# EAGLE design TAU-ARD_V01 (EAGLE 9.7.0)
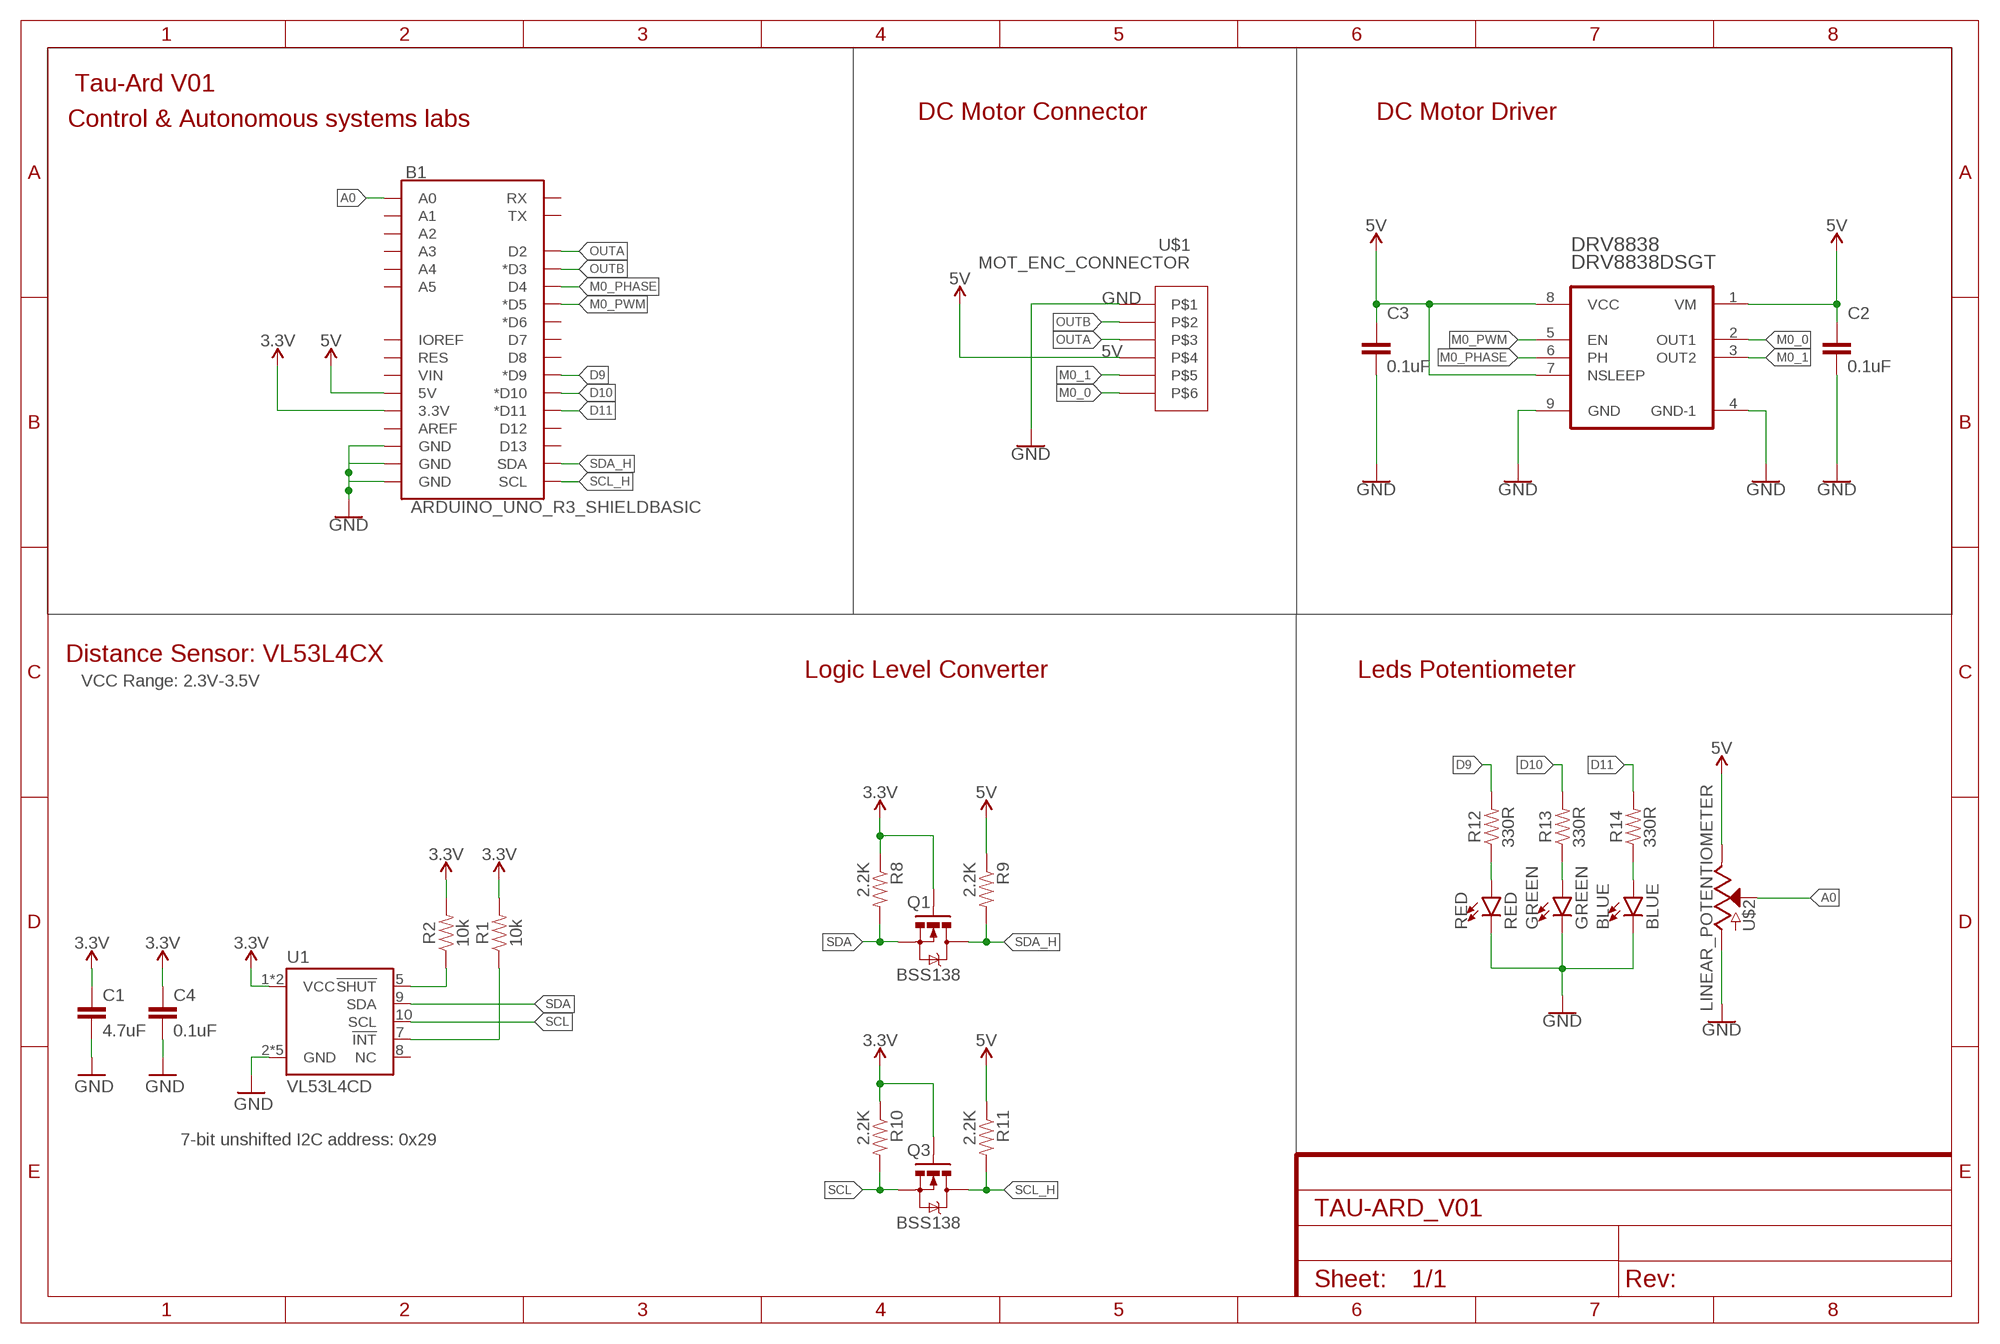
[diagram p0: schematic, sheet 1]

## Parts
B1  ARDUINO_UNO_R3_SHIELDBASIC  [UNO_R3_SHIELD]
BLUE  BLUE  LED-BLUE1206  [LED-1206]
C1  4.7uF  4.7UF-0603-6.3V-(10%)  [0603]
C2  0.1uF  0.1UF-0603-25V-(+80/-20%)  [0603]
C3  0.1uF  0.1UF-0603-25V-(+80/-20%)  [0603]
C4  0.1uF  0.1UF-0603-25V-(+80/-20%)  [0603]
DRV8838  DRV8838DSGT  [SON50P200X200X80-9N]
GREEN  GREEN  LED-GREEN1206  [LED-1206]
Q1  BSS138  MOSFET-NCHANNELSMD  [SOT23-3]
Q3  BSS138  MOSFET-NCHANNELSMD  [SOT23-3]
R1  10k  10KOHM-0603-1/10W-1%  [0603]
R2  10k  10KOHM-0603-1/10W-1%  [0603]
R8  2.2K  RESISTOR0603-RES  [0603-RES]
R9  2.2K  RESISTOR0603-RES  [0603-RES]
R10  2.2K  RESISTOR0603-RES  [0603-RES]
R11  2.2K  RESISTOR0603-RES  [0603-RES]
R12  330R  0.3OHM-0805-1/8W-1%  [0805]
R13  330R  0.3OHM-0805-1/8W-1%  [0805]
R14  330R  0.3OHM-0805-1/8W-1%  [0805]
RED  RED  LED-RED1206  [LED-1206]
U1  VL53L4CD  [VL53L4CD]
U$1  MOT_ENC_CONNECTOR  [6X1_CONNECTOR_2MM_SMD]
U$2  LINEAR_POTENTIOMETER  [PTA2043]

## Nets
3.3V: B1.3.3V C1.1 C4.1 Q1.1(G) Q3.1(G) R1.2 R2.2 R8.1 R10.1 U1.1(VCC) U1.11(VCC)
5V: B1.5V C2.1 C3.1 DRV8838.1(VM) DRV8838.7(NSLEEP) DRV8838.8(VCC) R9.1 R11.1 U$1.P$4 U$2.TOP(VCC)
!INT: R1.1 U1.7(!INT)
!SHUT: R2.1 U1.5(!SHUT)
A0: B1.A0 U$2.WIPER(SIG)
D9: B1.D9(*D9) R12.2
D10: B1.D10(*D10) R13.2
D11: B1.D11(*D11) R14.2
GND: B1.GND@0(GND) B1.GND@1(GND) B1.GND@2(GND) BLUE.C C1.2 C2.2 C3.2 C4.2 DRV8838.4(GND-1) DRV8838.9(GND) GREEN.C RED.C U1.2(GND) U1.3(GND) U1.4(GND) U1.6(GND) U1.12(GND) U$1.P$1 U$2.BOTTOM(GND)
M0_0: DRV8838.2(OUT1) U$1.P$6
M0_1: DRV8838.3(OUT2) U$1.P$5
M0_PHASE: B1.D4 DRV8838.6(PH)
M0_PWM: B1.D5(*D5) DRV8838.5(EN)
N$7: R12.1 RED.A
N$8: GREEN.A R13.1
N$9: BLUE.A R14.1
OUTA: B1.D2 U$1.P$3
OUTB: B1.D3(*D3) U$1.P$2
SCL: Q3.2(S) R10.2 U1.10(SCL)
SCL_H: B1.SCL Q3.3(D) R11.2
SDA: Q1.2(S) R8.2 U1.9(SDA)
SDA_H: B1.SDA Q1.3(D) R9.2
Unconnected: B1.A1 B1.A2 B1.A3 B1.A4 B1.A5 B1.AREF B1.D6(*D6) B1.D7 B1.D8 B1.D12 B1.D13 B1.IOREF B1.RES B1.RX B1.TX B1.VIN U1.8(NC)

## Notes on the sheet
- Tau-Ard V01
- Control & Autonomous systems labs | DC Motor Connector | DC Motor Driver
- Distance Sensor: VL53L4CX
- Logic Level Converter | Leds Potentiometer
- VCC Range: 2.3V-3.5V
- 7-bit unshifted I2C address: 0x29

## Library data of the parts
B1 = SparkFun-Boards:ARDUINO_UNO_R3_SHIELD: Arduino R3 Shield Footprint Shield form compatible with the Arduino Uno R3. SparkFun Products: MG2639 Cellular Shield <https://www.sparkfun.com/products/13120> MIDI Shield <https://www.sparkfun.com/products/12898> R3 Stackable Headers Kit <https://www.sparkfun.com/products/11417>
BLUE = SparkFun-LED:LED-BLUE: Blue SMD LED Used in manufacturing of various products at SparkFun Packages: 0603 - SMD 0603 package [Product Link] <http://www.digikey.com/product-detail/en/SMLE12BC7TT86/511-1589-2-ND/1641808> 1206 - SMD1206 package [Product Link] <http://www.digikey.com/product-detail/en/lite-on-inc/LTST-C150TBKT/160-1643-1-ND/573584> SparkFun Products: ESP8266 Thing-Dev Board <https://www.sparkfun.com/products/13711> RedBoard <https://www.sparkfun.com/products/12757>; PROD_ID: DIO-09911
C1 = SparkFun-Capacitors:4.7UF: 4.7µF ceramic capacitors A capacitor is a passive two-terminal electrical component used to store electrical energy temporarily in an electric field.; PROD_ID: CAP-08280
C2-C4 = SparkFun-Capacitors:0.1UF: 0.1µF ceramic capacitors A capacitor is a passive two-terminal electrical component used to store electrical energy temporarily in an electric field.; PROD_ID: CAP-00810
DRV8838 = DRV8838DSGT:DRV8838DSGT; DESCRIPTION: 11-V, 1.8-A H-bridge motor driver with phase/enable control 8-WSON -40 to 85; DIGI-KEY_PART_NUMBER: 296-37539-1-ND; MF: Texas Instruments; MP: DRV8838DSGT; PACKAGE: WSON-8 Texas Instruments; PURCHASE-URL: https://pricing.snapeda.com/search/part/DRV8838DSGT/?ref=eda
GREEN = SparkFun-LED:LED-GREEN: Green SMD LED Used in manufacturing of various products at SparkFun Packages: 0603 - SMD 0603 package [Product Link] <http://www.futureelectronics.com/en/technologies/semiconductors/optoelectronics/leds/Pages/9894312-LTST-C190GKT.aspx?CrossPart=HSMG-C190&IM=0> LilyPad 1206 - SMD1206 LilyPad package [Product Link] <http://www.futureelectronics.com/en/Technologies/Product.aspx?ProductID=IN150NGHARVATEKCORPORATION2049943&IM=0> 1206 - SMD1206 package [Product Link] <http://www.futureelectronics.com/en/technologies/semiconductors/optoelectronics/leds/Pages/8315665-LTST-C150KGKT.aspx?IM=0> 1206 Bottom Mount -SMD 1206 Bottom Mount [Product Link] <http://www.digikey.com/product-detail/en/lite-on-inc/LTST-C230KGKT/160-1456-1-ND/386854> SparkFun Products: Pro Mini 328 -5V <https://www.sparkfun.com/products/821> RedBoard <https://www.sparkfun.com/products/12757> MP3 Trigger <https://www.sparkfun.com/products/13720> Makey Makey <https://www.sparkfun.com/products/11076>; PROD_ID: DIO-00862
Q1 Q3 = SparkFun:MOSFET-NCHANNEL
R1 R2 = SparkFun-Resistors:10KOHM: 10kΩ resistor A resistor is a passive two-terminal electrical component that implements electrical resistance as a circuit element. Resistors act to reduce current flow, and, at the same time, act to lower voltage levels within circuits. - Wikipedia; PROD_ID: RES-00824
R8-R11 = SparkFun:RESISTOR: Resistor Basic schematic elements and footprints for 0603, 1206, and PTH resistors.
R12-R14 = SparkFun-Resistors:0.3OHM: 0.3Ω resistor A resistor is a passive two-terminal electrical component that implements electrical resistance as a circuit element. Resistors act to reduce current flow, and, at the same time, act to lower voltage levels within circuits. - Wikipedia; PROD_ID: RES-11622; VALUE: 0.3
RED = SparkFun-LED:LED-RED: Red SMD LED Used in manufacturing of most products at SparkFun Packages: 0603 - SMD 0603 package [Product Link] <http://docs.avagotech.com/docs/AV02-0551EN> 0603 SMART - SMD 0603 SMART package ( more efficient and expensive)[Product Link] <http://www.osram-os.com/Graphics/XPic2/00077099_0.pdf> 1206 - SMD1206 package [Product Link] <https://www.sparkfun.com/datasheets/DevTools/LilyPad/Q150OVS4.pdff> SparkFun Products: Pro Mini 328 -5V <https://www.sparkfun.com/products/821> RedBoard <https://www.sparkfun.com/products/12757> IOIO-OTG <https://www.sparkfun.com/products/13613>; PROD_ID: DIO-09912
U1 = DISTANCE:VL53L4CD: STMicroelectronics VL53L4D - IR Laser Distance Sensor; PROD_ID: IC-16332
U$1 = My_Connectors:MOT_ENC_CONNECTOR
U$2 = My_Passives:LINEAR_POTENTIOMETER

## Board
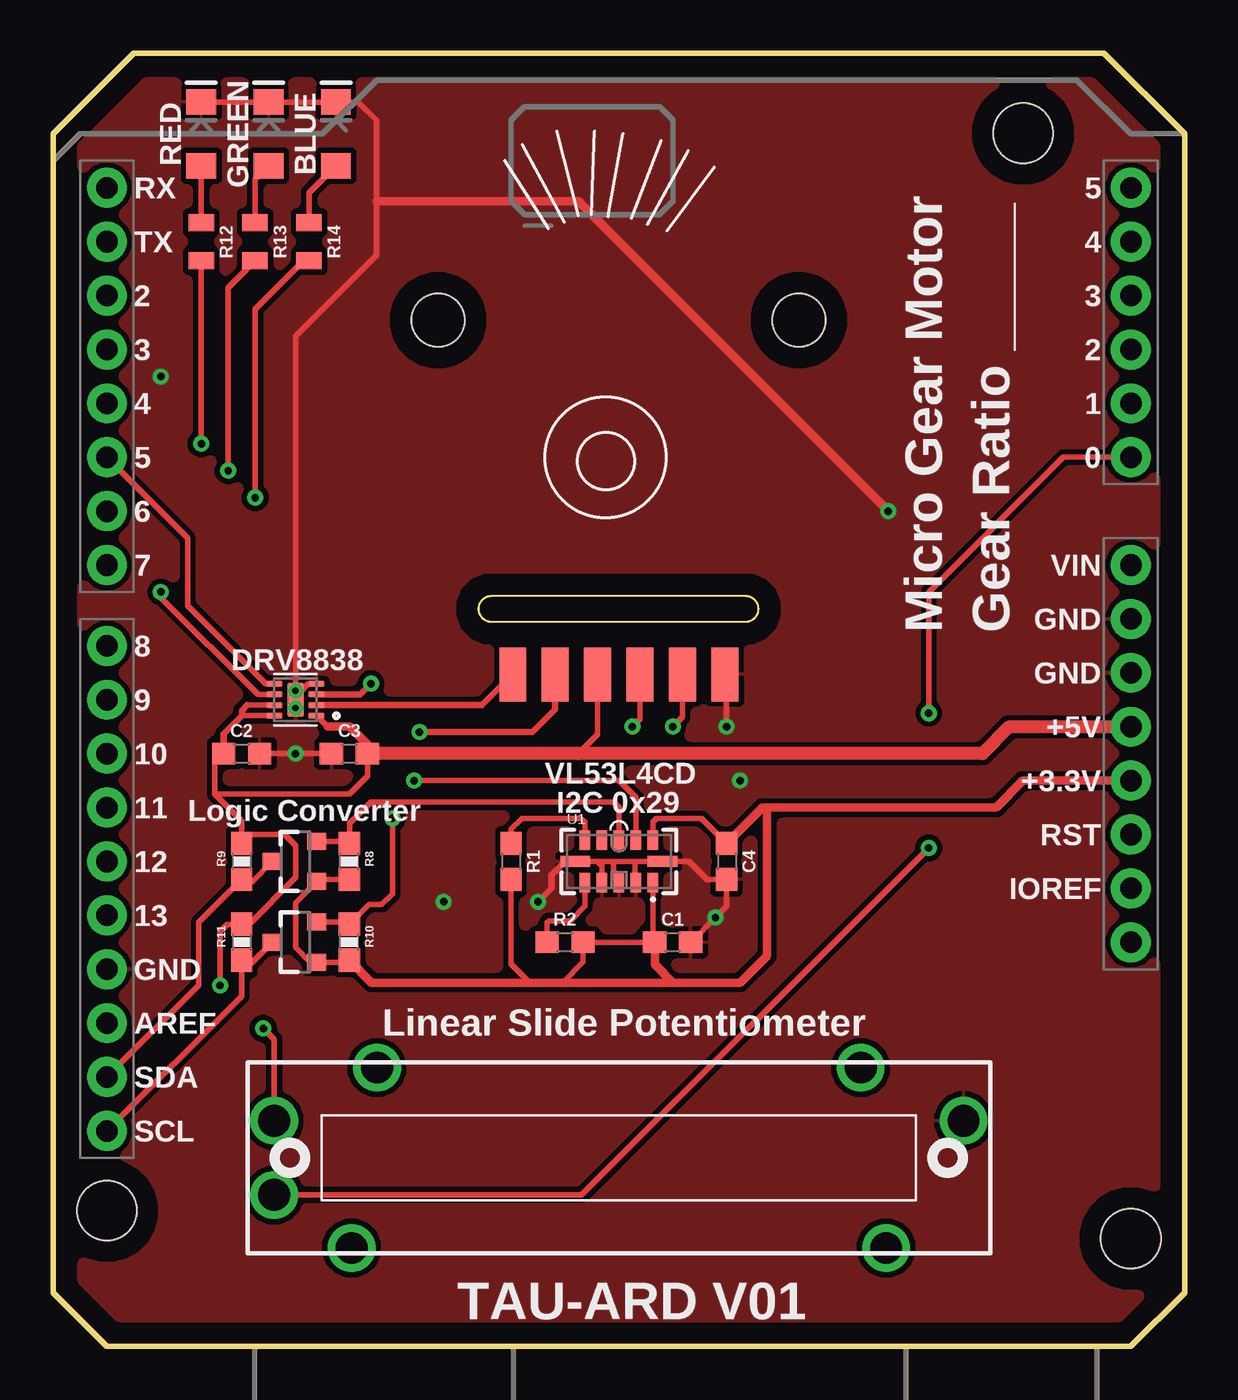
[diagram p1: board, top side]
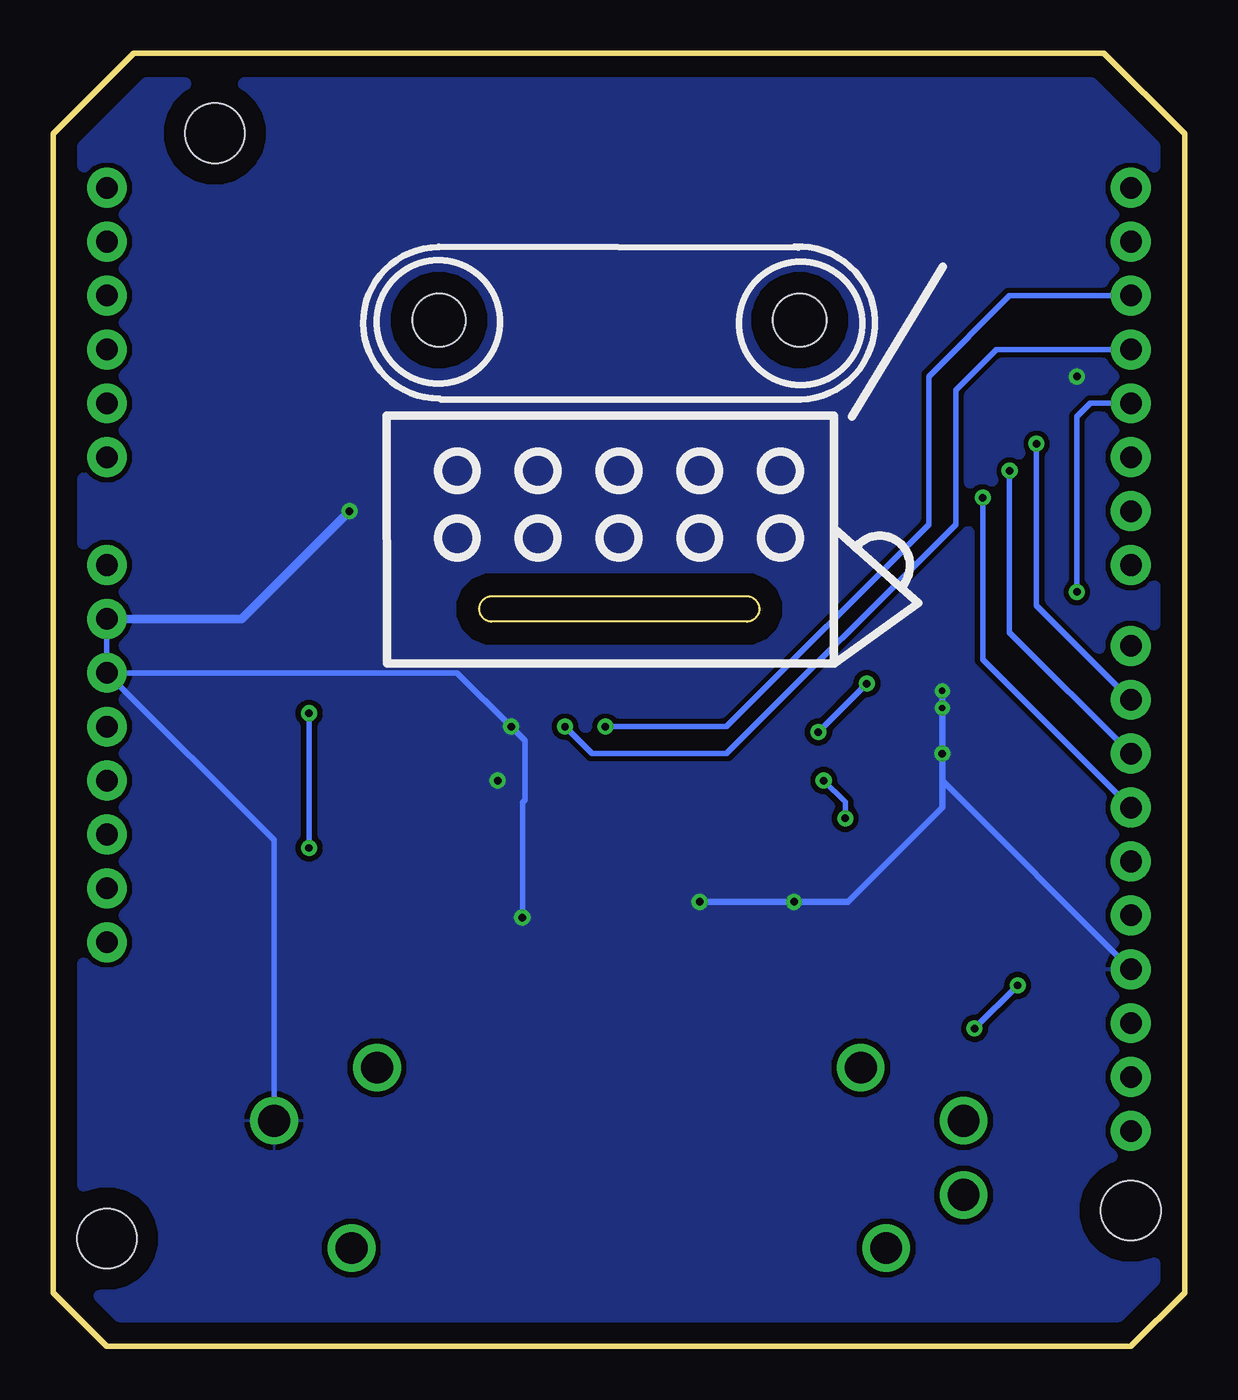
[diagram p2: board, bottom side, seen from below]

Size 53.34 x 60.96 mm. Coordinates in mm from the lower left corner, seen from the top.
Outline: 2.54,0 0,2.54 0,57.15 3.81,60.96 49.53,60.96 53.34,57.15 53.34,2.54 50.8,0 2.54,0
Outline: 32.65,35.36 20.65,35.36 arc180 20.65,34.16 32.65,34.16 arc180 32.65,35.36
Copper layers (1*16): Top 0.035mm / dielectric 1.5mm / Bottom 0.035mm
Design rules "default": minimum track width 6mil, minimum drill 0.35mm, track to track 6mil, track to pad 6mil, pad to pad 6mil, via to via 6mil, smd to smd 6mil, copper to edge 40mil, drill to drill 6mil, minimum pad ring 10mil, minimum via ring 8mil, stop-mask expansion 4mil, vias tented up to drill 0mil, thermal gap 10mil
Holes 2.5 mm at 18.15,48.37 35.15,48.37
Holes 2.8 mm at 2.54,6.4 50.8,5.09 45.72,57.18

### Footprints (pad centres in the part's own frame; a part is rotated, then mirrored left to right if it is on the bottom)
UNO_R3_SHIELD = drill 1.016 pad 1.88: 3.3V 24.13,-2.54; 5V 24.13,0; A0 24.13,12.7; A1 24.13,15.24; A2 24.13,17.78; A3 24.13,20.32; A4 24.13,22.86; A5 24.13,25.4; AREF -24.13,-13.97; D2 -24.13,20.32; D3 -24.13,17.78; D4 -24.13,15.24; D5 -24.13,12.7; D6 -24.13,10.16; D7 -24.13,7.62; D8 -24.13,3.81; D9 -24.13,1.27; D10 -24.13,-1.27; D11 -24.13,-3.81; D12 -24.13,-6.35; D13 -24.13,-8.89; GND@0 24.13,2.54; GND@1 24.13,5.08; GND@2 -24.13,-11.43; IOREF 24.13,-7.62; NC 24.13,-10.16; RES 24.13,-5.08; RX -24.13,25.4; SCL -24.13,-19.05; SDA -24.13,-16.51; TX -24.13,22.86; VIN 24.13,7.62
LED-1206 = smd 1.2 x 1.4: A -1.5,0; C 1.5,0
0603 = smd 1.1 x 1: 1 -0.85,0; 2 0.85,0
SON50P200X200X80-9N = smd 0.74 x 0.28: 1 -0.985,0.75; 2 -0.985,0.25; 3 -0.985,-0.25; 4 -0.985,-0.75; 5 0.985,-0.75; 6 0.985,-0.25; 7 0.985,0.25; 8 0.985,0.75 | smd 0.8 x 1.6: 9 0,0
SOT23-3 = smd 0.8 x 0.9: 1 -0.95,-1; 2 0.95,-1; 3 0,1.1
0603-RES = smd 1.1 x 1: 1 -0.85,0; 2 0.85,0
0805 = smd 0.8 x 1.2: 1 -0.9,0; 2 0.9,0
VL53L4CD = smd 0.5 x 0.9: 1 1.6,-1; 2 0.8,-1; 3 0,-1; 4 -0.8,-1; 5 -1.6,-1; 7 -1.6,1; 8 -0.8,1; 9 0,1; 10 0.8,1; 11 1.6,1 | smd 1.4 x 0.5: 6 -2.05,0; 12 2.05,0
6X1_CONNECTOR_2MM_SMD = smd 2.54 x 1.27: P$1 0,5; P$2 0,3; P$3 0,1; P$4 0,-1; P$5 0,-3; P$6 0,-5
PTA2043 = drill 1.5: BOTTOM 16.25,1.75; P$1 11.4,4.25; P$2 -11.4,4.25; P$3 -12.6,-4.25; P$4 12.6,-4.25; TOP -16.25,1.75; WIPER -16.25,-1.75

### Placement (x,y rotation side)
B1  26.67,29.21 0 top
BLUE  13.34,57.15 90 top
C1  29.21,19.05 0 top
C2  8.89,27.94 0 top
C3  13.97,27.94 180 top
C4  31.75,22.86 270 top
DRV8838  11.43,30.48 180 top
GREEN  10.16,57.15 90 top
Q1  11.43,22.86 90 top
Q3  11.43,19.05 90 top
R1  21.59,22.86 270 top
R2  24.13,19.05 0 top
R8  13.97,22.86 90 top
R9  8.89,22.86 270 top
R10  13.97,19.05 90 top
R11  8.89,19.05 270 top
R12  6.99,52.07 270 top
R13  9.53,52.07 270 top
R14  12.06,52.07 270 top
RED  6.99,57.15 90 top
U1  26.67,22.86 0 top
U$1  26.67,31.68 270 top
U$2  26.67,8.89 0 top

### Tracks (layer width: path | path; a pad name or v marks a point on that pad's centre or on a via)
3.3V
  Top 0.254: U1.1 28.27,19.14 C1.1 R2.2 24.98,18.12 24,17.14 22.48,17.14 21.59,18.03 R1.2 | U1.11 28.27,24.71 28.45,24.89 30.57,24.89 C4.1 | R10.1 13.87,18.1 Q3.1 12.13,18.1 11.43,18.8 11.43,20.91 Q1.1 12.53,22.01 R8.1
  Top 0.406: B1.3.3V 45.72,26.67 44.45,25.4 33.66,25.4 | 33.66,25.4 33.44,25.4 C4.1 | 33.66,25.4 33.66,18.41 32.38,17.14 29.21,17.14 | 29.21,17.14 28.36,18 C1.1 | 29.21,17.14 15.03,17.14 R10.1
5V  (via drill 0.35)
  Top 0.254: U$2.TOP 10.42,14.47 v9.91,14.99 | v7.87,17.02 7.87,19.56 8.22,19.9 R11.1 9.23,19.9 11.43,22.1 11.43,23.62 10.92,24.13 9.31,24.13 R9.1 8.89,24.77 7.62,26.04 | U$1.P$4 25.67,28.84 24.77,27.94 | 7.62,26.04 7.62,27.52 C2.1 | 7.62,26.04 13.97,26.04 14.82,26.89 C3.1 | 9.15,30.23 DRV8838.7 | DRV8838.8 8.9,29.73
  Top 0.305: C2.1 8.04,28.87 8.9,29.73 8.9,29.98 9.15,30.23 | 14.82,28.36 C3.1 | DRV8838.1 12.94,29.21
  Top 0.406: 12.94,29.21 13.97,29.21 14.82,28.36
  Top 0.61: B1.5V 45.09,29.21 43.81,27.94 24.77,27.94 C3.1
  Bottom 0.254: v9.91,14.99 v7.87,17.02
!INT
  Top 0.254: U1.7 25.07,24.71 24.89,24.89 22.1,24.89 21.59,24.38 R1.1
!SHUT
  Top 0.254: U1.5 25.07,20.75 24.38,20.07 23.37,20.07 23.28,19.98 R2.1
A0  (via drill 0.35)
  Top 0.254: U$2.WIPER 24.92,7.14 v41.27,23.5 | v41.27,29.84 41.27,35.56 47.62,41.91 B1.A0
  Bottom 0.254: v41.27,23.5 v41.27,29.84
D9  (via drill 0.35)
  Top 0.254: v6.99,42.55 R12.2
  Bottom 0.254: B1.D9 6.99,34.92 v6.99,42.55
D10  (via drill 0.35)
  Top 0.254: R13.2 8.26,49.9 v8.26,41.27
  Bottom 0.254: B1.D10 8.26,33.66 v8.26,41.27
D11  (via drill 0.35)
  Top 0.254: R14.2 11.8,51.17 9.53,48.9 v9.53,40.01
  Bottom 0.254: B1.D11 9.53,32.38 v9.53,40.01
GND  (via drill 0.3, 0.35)
  Top 0.254: U1.4 25.87,22.64 25.65,22.86 | 25.65,22.86 U1.6 | 27.43,22.86 U1.12 29.97,22.86 30.82,22.01 C4.2 31.75,20.74 v31.22,20.21 C1.2 | 27.43,22.86 26.42,22.86 | 26.42,22.86 25.65,22.86 | U1.2 27.43,21.9 27.43,22.86 | U1.3 26.42,22.11 26.42,22.86 | C2.2 v11.43,27.94 C3.2 | RED.C GREEN.C BLUE.C 14.38,58.65 15.24,57.78 15.24,53.98 15.24,51.44 11.43,47.62 v11.43,30.9 | U$1.P$1 31.75,31.6 v31.75,29.21 | DRV8838.9 11.38,30.53 11.38,30.58 12.03,31.23 DRV8838.4
  Top 0.305: v22.86,20.95 23.5,21.59 23.5,22.23 24.13,22.86 U1.6 | DRV8838.9 v11.43,30.09
  Top 0.406: v39.37,39.37 24.77,53.98 15.24,53.98
  Bottom 0.254: B1.GND@2 11.43,26.67 v11.43,27.94 | B1.GND@0 34.29,31.75 v31.75,29.21 31.09,28.55 31.09,25.76 31.22,25.63 v31.22,20.21 | B1.GND@1 B1.GND@0 | U$2.BOTTOM 42.92,23.87 B1.GND@0
  Bottom 0.305: v22.86,20.95 v18.41,20.95 15.88,20.95 11.43,25.4 v11.43,27.94 v11.43,30.09 v11.43,30.9
  Bottom 0.406: B1.GND@1 44.45,34.29 v39.37,39.37
  other vias: 32.38,26.67 5.08,45.72
  pour Top (isolate 0.254): 0,60.96 0,0 53.34,0 53.34,60.96
  pour Bottom (isolate 0.254): 0,60.96 0,0 53.34,0 53.34,60.96
M0_0
  Top 0.305: U$1.P$6 20.22,30.23 DRV8838.2
M0_1  (via drill 0.35)
  Top 0.305: v14.99,31.24 14.47,30.73 DRV8838.3 | v17.27,28.96 22.61,28.96 23.67,30.02 U$1.P$5
  Bottom 0.305: v17.27,28.96 v14.99,31.24
M0_PHASE  (via drill 0.35)
  Top 0.254: v5.08,35.56 5.08,35.31 9.66,30.73 DRV8838.6
  Bottom 0.254: v5.08,35.56 5.08,43.81 4.45,44.45 B1.D4
M0_PWM
  Top 0.254: B1.D5 6.35,38.1 6.35,34.92 10.04,31.23 DRV8838.5
N$7
  Top 0.254: R12.1 RED.A
N$8
  Top 0.254: R13.1 9.53,55.02 GREEN.A
N$9
  Top 0.254: R14.1 12.06,54.38 BLUE.A
OUTA  (via drill 0.35)
  Top 0.254: U$1.P$3 27.67,29.57 v27.3,29.21
  Bottom 0.254: v27.3,29.21 21.59,29.21 12.06,38.73 12.06,45.72 8.26,49.53 B1.D2
OUTB  (via drill 0.35)
  Top 0.254: U$1.P$2 29.67,29.67 v29.21,29.21
  Bottom 0.254: v29.21,29.21 27.94,27.94 21.59,27.94 10.79,38.73 10.79,45.09 8.89,46.99 B1.D3
SCL  (via drill 0.35)
  Top 0.254: v16,24.89 16,21.34 15.49,20.83 14.9,20.83 R10.2 13.87,20 Q3.2 | v17.02,26.67 26.67,26.67 27.47,25.87 U1.10
  Bottom 0.254: v16,24.89 16,25.65 v17.02,26.67
SCL_H
  Top 0.254: B1.SCL 8.89,16.51 8.89,18.03 | 8.89,18.03 R11.2 | Q3.3 9.31,18.03 8.89,18.03
SDA
  Top 0.254: U1.9 26.67,25.4 26.42,25.65 14.99,25.65 13.97,24.64 R8.2 13.87,23.81 Q1.2
SDA_H
  Top 0.254: B1.SDA 6.86,17.02 6.86,19.98 8.81,21.93 | 8.81,21.93 R9.2 | Q1.3 9.4,21.93 8.81,21.93

### Text on the board
tNames: Micro Gear Motor | Gear Ratio _____ | VL53L4CD | Logic Converter | I2C 0x29 | Linear Slide Potentiometer | TAU-ARD V01